# Altium schematic sheet 10_LCDC_MAC_I2S1_JTAG.SchDoc: P30L
size A3; Organization: 六零加智能科技; Address4: www.nidone.com.cn; DocumentNumber: Kang jin; Revision: 1.0; SheetNumber: 10; SheetTotal: 23
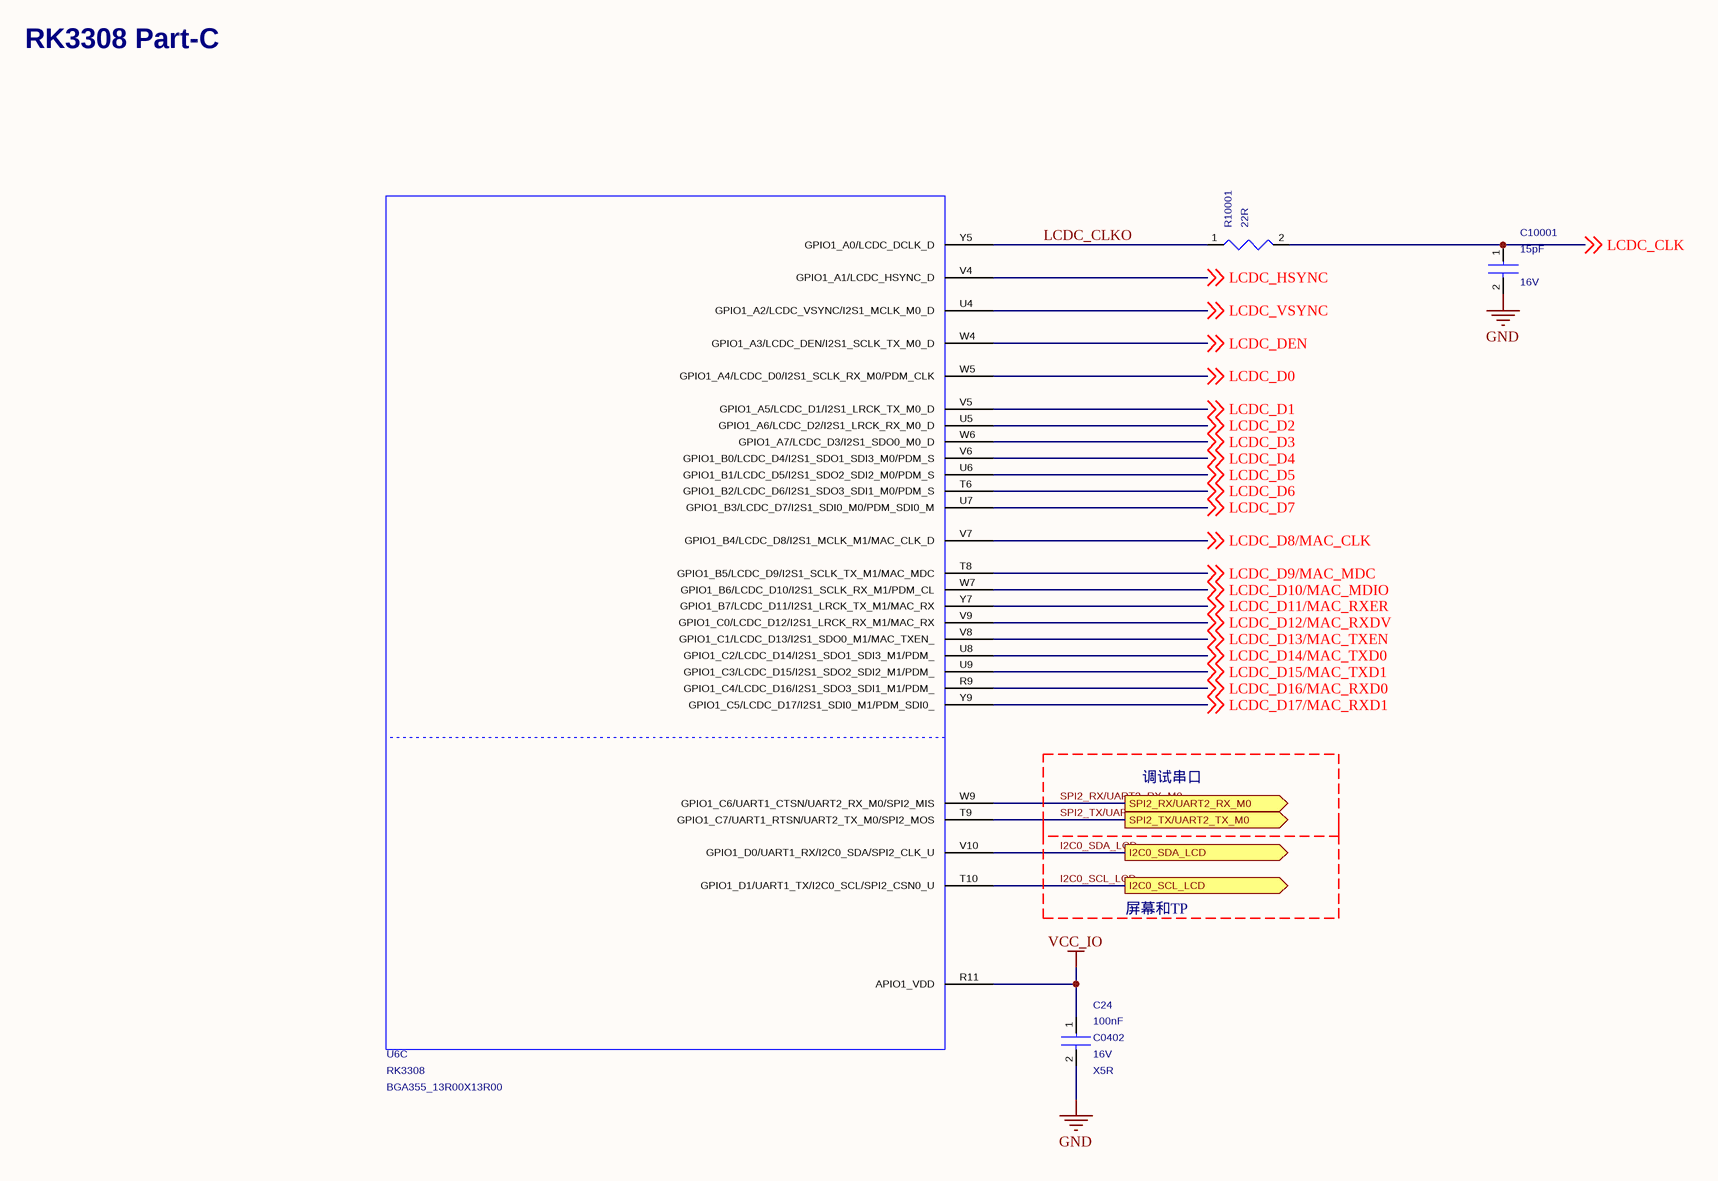
[diagram p0: 10_LCDC_MAC_I2S1_JTAG.SchDoc]

## Parts
C24  value 100nF  Dielectric: X5R  Voltage: 16V  [C0402]  (hidden comment: CAP_NP_2)
C10001  value 15pF  Voltage: 16V  [C0402]  (hidden comment: CAP_NP_2)
R10001  value 22R  [R0402]  (hidden comment: RESISTOR)
U6  RK3308  [BGA355_13R00X13R00]  (part C of 14)

## Ports
I2C0_SCL_LCD (out), I2C0_SDA_LCD (out), SPI2_RX/UART2_RX_M0 (out), SPI2_TX/UART2_TX_M0 (out)

## Nets
GND: C24.2 C10001.2
VCC_IO: C24.1 U6.R11(APIO1_VDD)
I2C0_SCL_LCD: U6.T10(GPIO1_D1/UART1_TX/I2C0_SCL/SPI2_CSN0_U) ; port I2C0_SCL_LCD
I2C0_SDA_LCD: U6.V10(GPIO1_D0/UART1_RX/I2C0_SDA/SPI2_CLK_U) ; port I2C0_SDA_LCD
LCDC_CLK: C10001.1 R10001.2 ; off-sheet LCDC_CLK
LCDC_CLKO: R10001.1 U6.Y5(GPIO1_A0/LCDC_DCLK_D)
LCDC_D0: U6.W5(GPIO1_A4/LCDC_D0/I2S1_SCLK_RX_M0/PDM_CLK) ; off-sheet LCDC_D0
LCDC_D1: U6.V5(GPIO1_A5/LCDC_D1/I2S1_LRCK_TX_M0_D) ; off-sheet LCDC_D1
LCDC_D2: U6.U5(GPIO1_A6/LCDC_D2/I2S1_LRCK_RX_M0_D) ; off-sheet LCDC_D2
LCDC_D3: U6.W6(GPIO1_A7/LCDC_D3/I2S1_SDO0_M0_D) ; off-sheet LCDC_D3
LCDC_D4: U6.V6(GPIO1_B0/LCDC_D4/I2S1_SDO1_SDI3_M0/PDM_S) ; off-sheet LCDC_D4
LCDC_D5: U6.U6(GPIO1_B1/LCDC_D5/I2S1_SDO2_SDI2_M0/PDM_S) ; off-sheet LCDC_D5
LCDC_D6: U6.T6(GPIO1_B2/LCDC_D6/I2S1_SDO3_SDI1_M0/PDM_S) ; off-sheet LCDC_D6
LCDC_D7: U6.U7(GPIO1_B3/LCDC_D7/I2S1_SDI0_M0/PDM_SDI0_M) ; off-sheet LCDC_D7
LCDC_D8/MAC_CLK: U6.V7(GPIO1_B4/LCDC_D8/I2S1_MCLK_M1/MAC_CLK_D) ; off-sheet LCDC_D8/MAC_CLK
LCDC_D9/MAC_MDC: U6.T8(GPIO1_B5/LCDC_D9/I2S1_SCLK_TX_M1/MAC_MDC) ; off-sheet LCDC_D9/MAC_MDC
LCDC_D10/MAC_MDIO: U6.W7(GPIO1_B6/LCDC_D10/I2S1_SCLK_RX_M1/PDM_CL) ; off-sheet LCDC_D10/MAC_MDIO
LCDC_D11/MAC_RXER: U6.Y7(GPIO1_B7/LCDC_D11/I2S1_LRCK_TX_M1/MAC_RX) ; off-sheet LCDC_D11/MAC_RXER
LCDC_D12/MAC_RXDV: U6.V9(GPIO1_C0/LCDC_D12/I2S1_LRCK_RX_M1/MAC_RX) ; off-sheet LCDC_D12/MAC_RXDV
LCDC_D13/MAC_TXEN: U6.V8(GPIO1_C1/LCDC_D13/I2S1_SDO0_M1/MAC_TXEN_) ; off-sheet LCDC_D13/MAC_TXEN
LCDC_D14/MAC_TXD0: U6.U8(GPIO1_C2/LCDC_D14/I2S1_SDO1_SDI3_M1/PDM_) ; off-sheet LCDC_D14/MAC_TXD0
LCDC_D15/MAC_TXD1: U6.U9(GPIO1_C3/LCDC_D15/I2S1_SDO2_SDI2_M1/PDM_) ; off-sheet LCDC_D15/MAC_TXD1
LCDC_D16/MAC_RXD0: U6.R9(GPIO1_C4/LCDC_D16/I2S1_SDO3_SDI1_M1/PDM_) ; off-sheet LCDC_D16/MAC_RXD0
LCDC_D17/MAC_RXD1: U6.Y9(GPIO1_C5/LCDC_D17/I2S1_SDI0_M1/PDM_SDI0_) ; off-sheet LCDC_D17/MAC_RXD1
LCDC_DEN: U6.W4(GPIO1_A3/LCDC_DEN/I2S1_SCLK_TX_M0_D) ; off-sheet LCDC_DEN
LCDC_HSYNC: U6.V4(GPIO1_A1/LCDC_HSYNC_D) ; off-sheet LCDC_HSYNC
LCDC_VSYNC: U6.U4(GPIO1_A2/LCDC_VSYNC/I2S1_MCLK_M0_D) ; off-sheet LCDC_VSYNC
SPI2_RX/UART2_RX_M0: U6.W9(GPIO1_C6/UART1_CTSN/UART2_RX_M0/SPI2_MIS) ; port SPI2_RX/UART2_RX_M0
SPI2_TX/UART2_TX_M0: U6.T9(GPIO1_C7/UART1_RTSN/UART2_TX_M0/SPI2_MOS) ; port SPI2_TX/UART2_TX_M0

## Notes on the sheet
- RK3308 Part-C
- 调试串口
- 屏幕和TP
- Title
- Size:
- Date:
- A3
- Engineer:
- Time:
- Revision:
- Sheet
- of
- File:

## Library data of the parts
C24 = CAP_NP_2: cap,100.00nF,+/-10%,16V,X5R,C0402; Manufacturer: TDK; RK_PN: C1005X5R1C104K050BA; Priority: A; Tolerance: 10%; Created_by: JJJ; Source_Path: Z:\RK_STANDARD_LIBRARY\CADENCE_CIS\RK_DISCRETE.OLB; Number: 1; C_Voltage: 6.3V; PCB DECAL: C0402; Part_Type: C0402; Manufacturer_PN: C1005X5R1C104K050BA
C10001 = CAP_NP_2: cap,15pF,+/-10%,16V,X5R,C0402; Manufacturer: TDK; RK_PN: C1005X5R1C104K050BA; Priority: A; Tolerance: 10%; Created_by: JJJ; Source_Path: Z:\RK_STANDARD_LIBRARY\CADENCE_CIS\RK_DISCRETE.OLB; Number: 1; C_Voltage: 6.3V; PCB DECAL: C0402; Part_Type: C0402; Dielectric: X5R; Manufacturer_PN: C1005X5R1C104K050BA
R10001 = RESISTOR: ?用厚膜电阻,22R,+/-1%,R0402,1/16W.; Manufacturer_PN: RC0402FR-0751KL; Manufacturer: YAGEO; Created_by: YTL; Wattage: 1/16W; Tolerance: 1%; Priority: A; Source_Path: Z:\RK_STANDARD_LIBRARY\CADENCE_CIS\RK_DISCRETE.OLB; Option: DNP; Part_Type: ?用厚膜电阻; RK_PN: RC0402FR-0751KL; PCB DECAL: R0402
U6 = RK3308: Manufacturer: ROCKCHIP; Source_Path: E:\SCHEMETIC\RKSCH.OLB; Number: 1; Manufacturer_PN: RK3308; PCB DECAL: BGA355_13R00X13R00; Value: RK3308